# EAGLE design untitled (EAGLE 7.3.0)
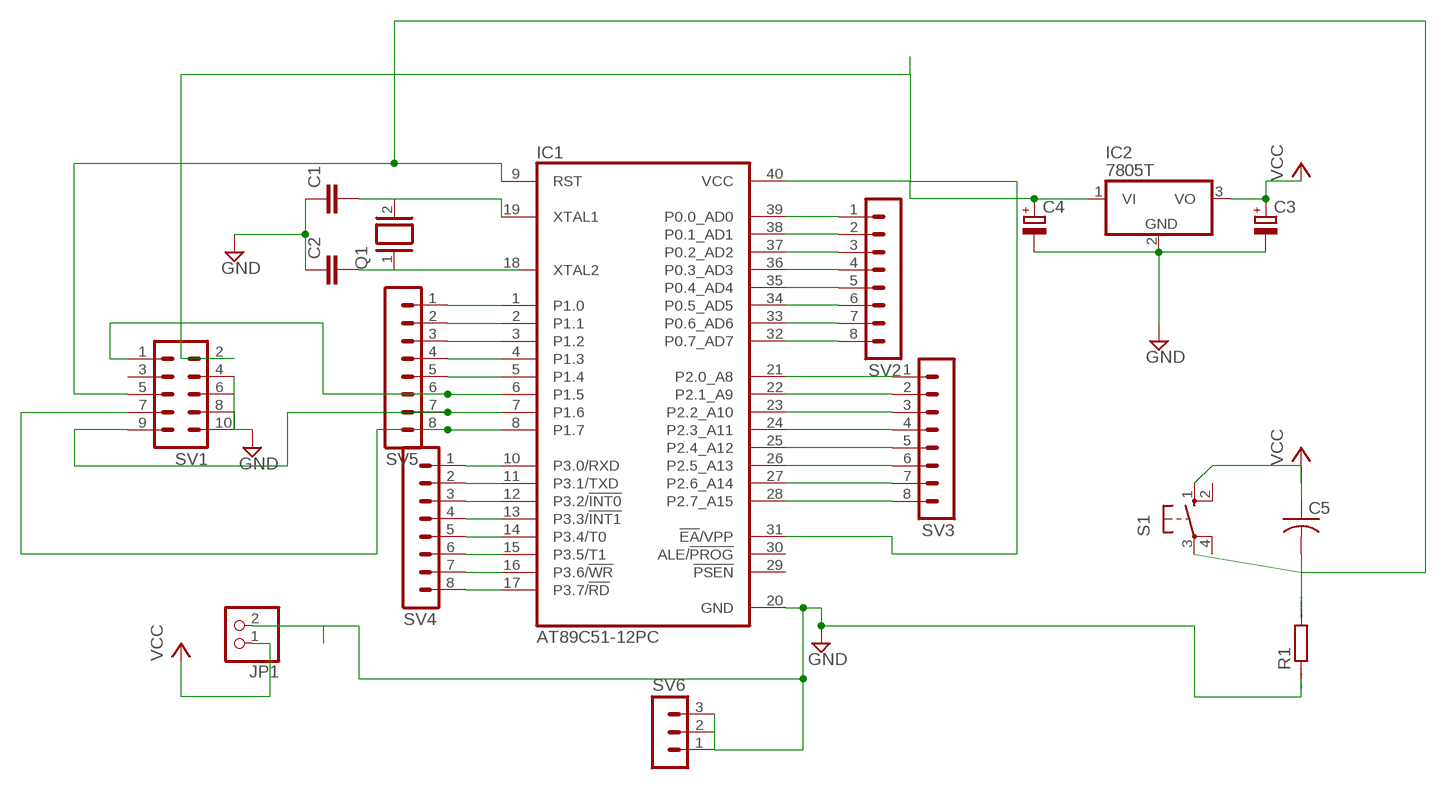
[diagram p0: schematic, sheet 1]

## Parts
C1  C2,5-3  [C2.5-3]
C2  C2,5-3  [C2.5-3]
C3  CPOL-EUB45181A  [B45181A]
C4  CPOL-EUB45181A  [B45181A]
C5  C-US025-024X044  [C025-024X044]
IC1  AT89C51-12PC  [DIL40]
IC2  7805T  [TO220H]
JP1  PINHD-1X2  [1X02]
Q1  XTAL/S  [QS]
R1  R0204/7  [0204/7]
S1  10-XX  [B3F-10XX]
SV1  MA05-2  [MA05-2]
SV2  MA08-1  [MA08-1]
SV3  MA08-1  [MA08-1]
SV4  MA08-1  [MA08-1]
SV5  MA08-1  [MA08-1]
SV6  MA03-1  [MA03-1]

## Nets
GND: C1.1 C2.1 C3.- C4.- IC1.20(GND) IC2.2(GND) JP1.2 R1.1 SV1.4 SV1.6 SV1.8 SV1.10 SV6.1 SV6.2 SV6.3
N$1: IC1.6(P1.5) SV1.1 SV5.6
N$2: IC1.7(P1.6) SV1.9 SV5.7
N$3: IC1.8(P1.7) SV1.7 SV5.8
N$4: C1.2 IC1.19(XTAL1) Q1.2
N$5: C2.2 IC1.18(XTAL2) Q1.1
N$7: C4.+ IC1.31(!EA!/VPP) IC1.40(VCC) IC2.1(VI) SV1.2
N$10: IC1.10(P3.0/RXD) SV4.1
N$11: IC1.11(P3.1/TXD) SV4.2
N$12: IC1.12(P3.2/!INT0) SV4.3
N$13: IC1.13(P3.3/!INT1) SV4.4
N$14: IC1.14(P3.4/T0) SV4.5
N$15: IC1.15(P3.5/T1) SV4.6
N$16: IC1.16(P3.6/!WR) SV4.7
N$17: IC1.17(P3.7/!RD) SV4.8
N$18: IC1.1(P1.0) SV5.1
N$19: IC1.2(P1.1) SV5.2
N$20: IC1.3(P1.2) SV5.3
N$21: IC1.4(P1.3) SV5.4
N$22: IC1.5(P1.4) SV5.5
N$23: IC1.21(P2.0_A8) SV3.1
N$24: IC1.22(P2.1_A9) SV3.2
N$25: IC1.23(P2.2_A10) SV3.3
N$26: IC1.24(P2.3_A11) SV3.4
N$27: IC1.25(P2.4_A12) SV3.5
N$28: IC1.26(P2.5_A13) SV3.6
N$29: IC1.27(P2.6_A14) SV3.7
N$30: IC1.28(P2.7_A15) SV3.8
N$31: IC1.39(P0.0_AD0) SV2.1
N$32: IC1.38(P0.1_AD1) SV2.2
N$33: IC1.37(P0.2_AD2) SV2.3
N$34: IC1.36(P0.3_AD3) SV2.4
N$35: IC1.35(P0.4_AD4) SV2.5
N$36: IC1.34(P0.5_AD5) SV2.6
N$37: IC1.33(P0.6_AD6) SV2.7
N$38: IC1.32(P0.7_AD7) SV2.8
N$40: C5.2 IC1.9(RST) R1.2 S1.3(P) SV1.5
VCC: C3.+ C5.1 IC2.3(VO) JP1.1 S1.1(S)
Unconnected: IC1.29(!PSEN) IC1.30(ALE/!PROG) S1.2(S1) S1.4(P1) SV1.3

## Library data of the parts
C1 C2 = capacitor-wima:C: CAPACITOR naming: grid - package width
C3 C4 = resistor:CPOL-EU: POLARIZED CAPACITOR, European symbol
C5 = rcl:C-US: CAPACITOR, American symbol
IC1 = atmel:AT89C51-*: 8-bit Microcontroller with 4K Bytes Flash Not Recommended for New Designs. Use AT89S51. Source: http://www.atmel.com/dyn/resources/prod_documents/doc0265.; OC_FARNELL: unknown; OC_NEWARK: unknown
IC2 = linear:78*: Positive VOLTAGE REGULATOR Source: http://cache.national.com/ds/LM/LM78L05.pdf http://www.fairchildsemi.com/ds/LM/LM7805.pdf
JP1 = pinhead:PINHD-1X2: PIN HEADER
Q1 = special:XTAL/S: CRYSTAL
R1 = eagle-ltspice:R: RESISTOR, European symbol; SPICEMODEL: NONE; SPICEPREFIX: R
S1 = switch-omron:10-XX: OMRON SWITCH; MPN: B3F-1000; OC_FARNELL: 176432; OC_NEWARK: 36M3542
SV1 = con-lstb:MA05-2: PIN HEADER; OC_FARNELL: unknown; OC_NEWARK: unknown
SV2-SV5 = con-lstb:MA08-1: PIN HEADER; OC_FARNELL: unknown; OC_NEWARK: unknown
SV6 = con-lstb:MA03-1: PIN HEADER; OC_FARNELL: unknown; OC_NEWARK: unknown

## Board
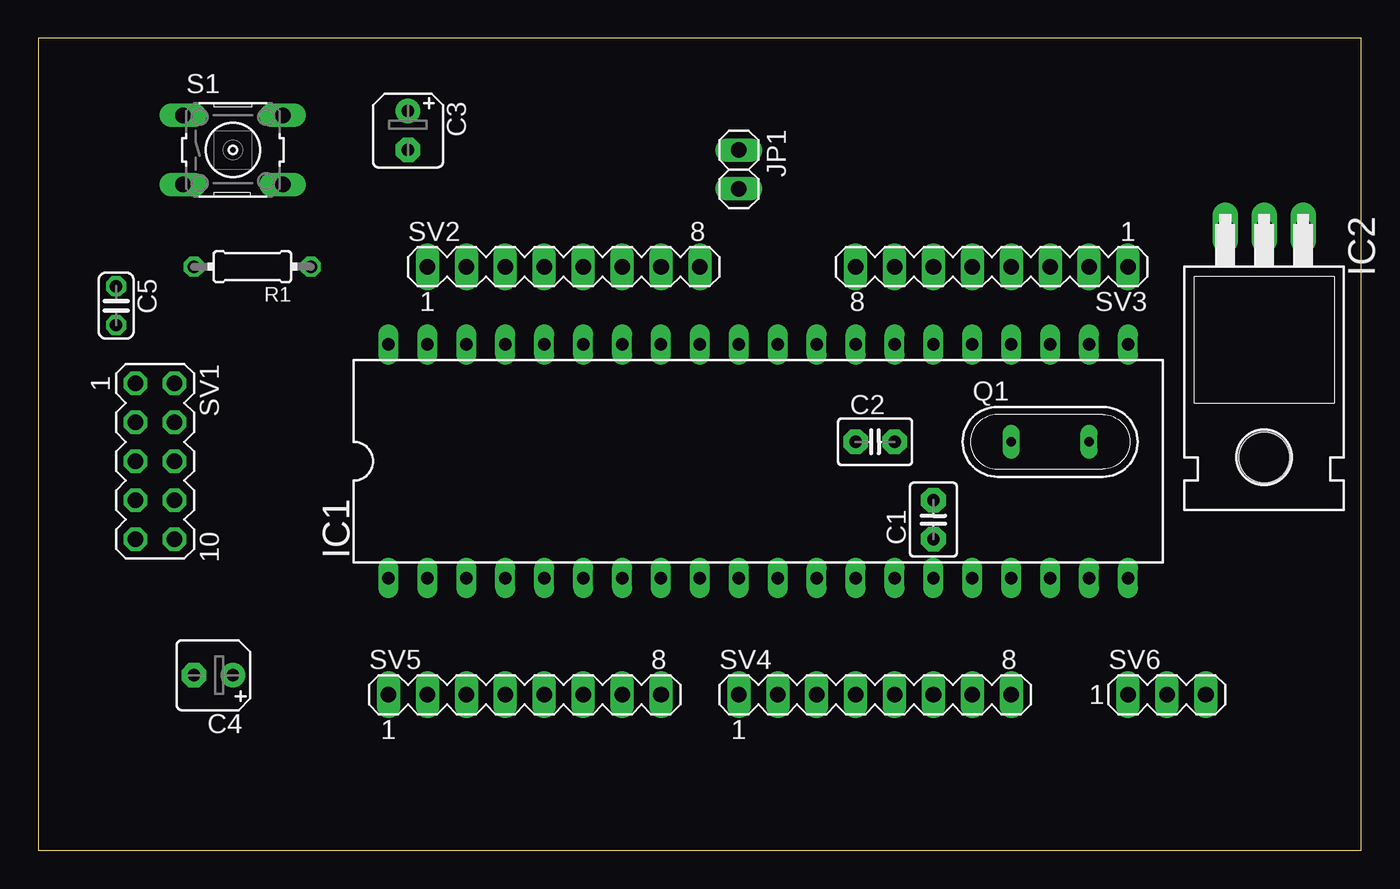
[diagram p1: board, top side]
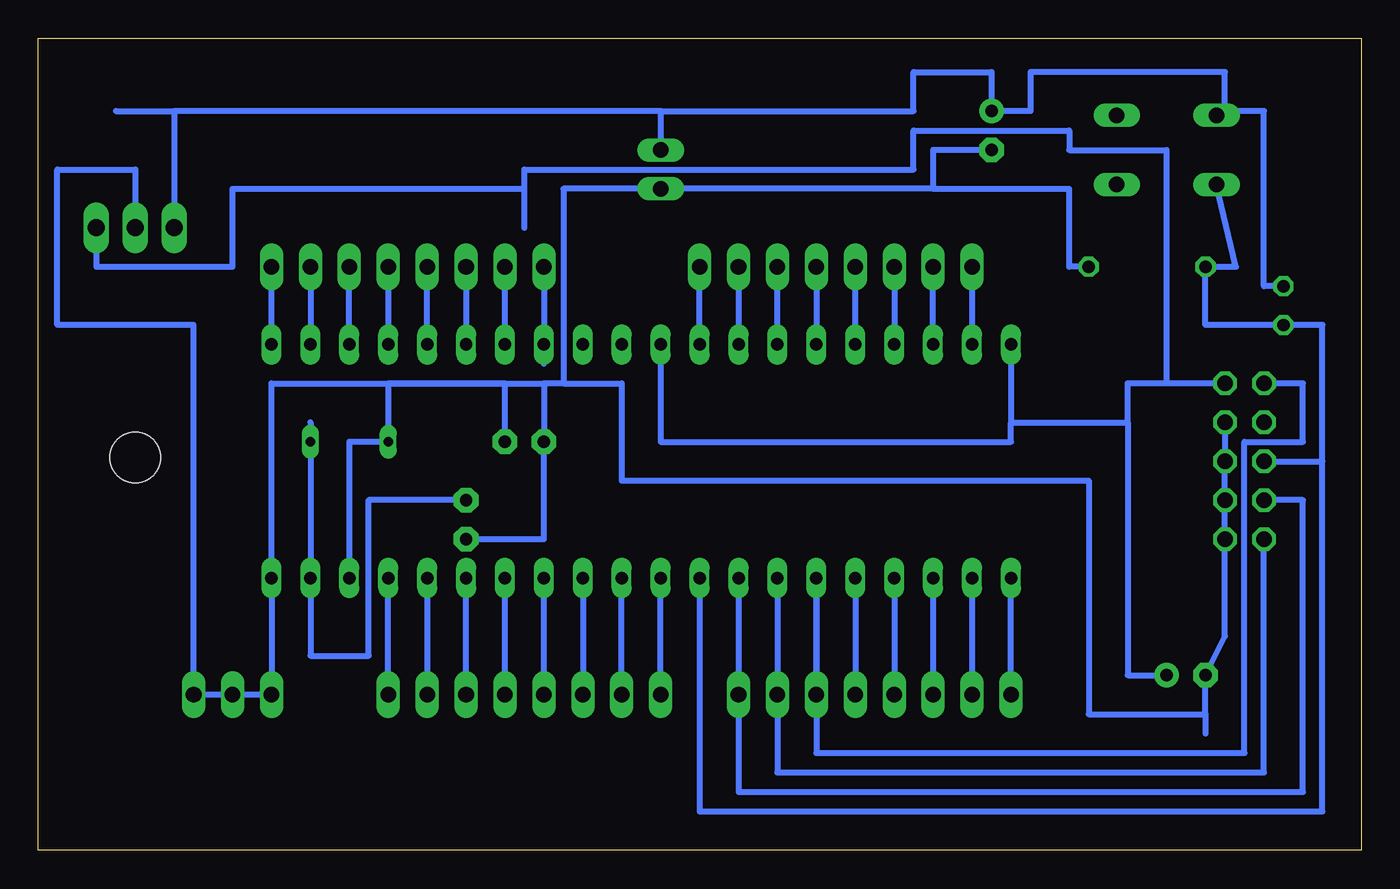
[diagram p2: board, bottom side, seen from below]

Size 86.34 x 53.01 mm. Coordinates in mm from the lower left corner, seen from the top.
Outline: 0,0 86.34,0 86.34,53.01 0,53.01 0,0
Copper layers (1*16): Top 0.035mm / dielectric 1.5mm / Bottom 0.035mm
Design rules "default": minimum track width 10mil, minimum drill 24mil, track to track 8mil, track to pad 8mil, pad to pad 8mil, via to via 8mil, smd to smd 8mil, copper to edge 40mil, drill to drill 8mil, minimum pad ring 10mil, minimum via ring 8mil, stop-mask expansion 4mil, vias tented up to drill 0mil, thermal gap 10mil

### Footprints (pad centres in the part's own frame; a part is rotated, then mirrored left to right if it is on the bottom)
C2.5-3 = drill 0.813 pad 1.6 octagon: 1 -1.27,0; 2 1.27,0
B45181A = drill 0.813 pad 1.6: + -1.27,0 | drill 0.813 pad 1.6 octagon: - 1.27,0
C025-024X044 = drill 0.813 octagon: 1 -1.27,0; 2 1.27,0
DIL40 = drill 0.813 long: 1 -24.13,-7.62; 2 -21.59,-7.62; 3 -19.05,-7.62; 4 -16.51,-7.62; 5 -13.97,-7.62; 6 -11.43,-7.62; 7 -8.89,-7.62; 8 -6.35,-7.62; 9 -3.81,-7.62; 10 -1.27,-7.62; 11 1.27,-7.62; 12 3.81,-7.62; 13 6.35,-7.62; 14 8.89,-7.62; 15 11.43,-7.62; 16 13.97,-7.62; 17 16.51,-7.62; 18 19.05,-7.62; 19 21.59,-7.62; 20 24.13,-7.62; 21 24.13,7.62; 22 21.59,7.62; 23 19.05,7.62; 24 16.51,7.62; 25 13.97,7.62; 26 11.43,7.62; 27 8.89,7.62; 28 6.35,7.62; 29 3.81,7.62; 30 1.27,7.62; 31 -1.27,7.62; 32 -3.81,7.62; 33 -6.35,7.62; 34 -8.89,7.62; 35 -11.43,7.62; 36 -13.97,7.62; 37 -16.51,7.62; 38 -19.05,7.62; 39 -21.59,7.62; 40 -24.13,7.62
TO220H = drill 1.118 long: 1 -2.54,-10.16; 2 0,-10.16; 3 2.54,-10.16 | hole 3.302: 0,4.826
1X02 = drill 1.016 long: 1 -1.27,0; 2 1.27,0
QS = drill 0.61 long: 1 -2.54,0; 2 2.54,0
0204/7 = drill 0.813 octagon: 1 -3.81,0; 2 3.81,0
B3F-10XX = drill 1.016 long: 1 -3.251,2.261; 2 3.251,2.261; 3 -3.251,-2.261; 4 3.251,-2.261
MA05-2 = drill 1.016 octagon: 1 -5.08,-1.27; 2 -5.08,1.27; 3 -2.54,-1.27; 4 -2.54,1.27; 5 0,-1.27; 6 0,1.27; 7 2.54,-1.27; 8 2.54,1.27; 9 5.08,-1.27; 10 5.08,1.27
MA08-1 = drill 1.016 long: 1 -8.89,0; 2 -6.35,0; 3 -3.81,0; 4 -1.27,0; 5 1.27,0; 6 3.81,0; 7 6.35,0; 8 8.89,0
MA03-1 = drill 1.016 long: 1 -2.54,0; 2 0,0; 3 2.54,0

### Placement (x,y rotation side)
C1  58.42,21.59 90 top
C2  54.61,26.67 0 top
C3  24.13,46.99 270 top
C4  11.43,11.43 180 top
C5  5.08,35.56 270 top
IC1  46.99,25.4 0 top
IC2  80.01,30.48 180 top
JP1  45.72,44.45 270 top
Q1  66.04,26.67 0 top
R1  13.97,38.1 180 top
S1  12.7,45.72 0 top
SV1  7.62,25.4 270 top
SV2  34.29,38.1 0 top
SV3  62.23,38.1 180 top
SV4  54.61,10.16 0 top
SV5  31.75,10.16 0 top
SV6  73.66,10.16 0 top

### Tracks (layer width: path | path; a pad name or v marks a point on that pad's centre or on a via)
GND
  Bottom 0.406: 53.34,30.48 71.12,30.48 IC1.20 SV6.1 SV6.2 SV6.3 76.2,34.29 85.09,34.29 85.09,44.45 80.01,44.45 IC2.2 | 53.34,30.48 C2.1 | 53.34,25.4 C2.1 | C1.1 53.34,20.32 C2.1 | 27.94,43.18 19.05,43.18 19.05,38.1 R1.1 | C3.- 27.94,45.72 27.94,43.18 | 52.07,30.48 53.34,30.48 | SV1.4 SV1.6 SV1.8 SV1.10 8.89,13.97 C4.- 10.16,8.89 | 27.94,43.18 JP1.2 52.07,43.18 52.07,30.48 | 52.07,30.48 48.26,30.48 48.26,24.13 17.78,24.13 17.78,8.89 10.16,8.89 | 10.16,8.89 10.16,7.62
N$1
  Bottom 0.406: SV5.6 IC1.6 35.56,6.35 7.62,6.35 7.62,26.67 3.81,26.67 3.81,30.48 SV1.1
N$2
  Bottom 0.406: IC1.7 SV5.7 | SV5.7 38.1,8.89 | SV5.7 38.1,5.08 6.35,5.08 SV1.9
N$3
  Bottom 0.406: SV5.8 IC1.8 40.64,3.81 3.81,3.81 3.81,22.86 SV1.7
N$4
  Bottom 0.406: 68.58,27.94 Q1.2 IC1.19 68.58,12.7 64.77,12.7 64.77,22.86 C1.2
N$5
  Bottom 0.406: IC1.18 66.04,26.67 Q1.1 63.5,30.48 55.88,30.48 C2.2
N$7
  Bottom 0.406: IC1.31 45.72,26.67 22.86,26.67 22.86,27.94 | IC1.40 22.86,27.94 | 22.86,27.94 15.24,27.94 | 15.24,27.94 15.24,30.48 12.7,30.48 | SV1.2 12.7,30.48 | 15.24,27.94 15.24,11.43 C4.+ | 54.61,40.64 54.61,43.18 | 54.61,43.18 54.61,44.45 29.21,44.45 29.21,46.99 19.05,46.99 19.05,45.72 12.7,45.72 12.7,30.48 | IC2.1 82.55,38.1 73.66,38.1 73.66,43.18 54.61,43.18
N$10
  Bottom 0.406: SV4.1 IC1.10
N$11
  Bottom 0.406: SV4.2 IC1.11
N$12
  Bottom 0.406: IC1.12 SV4.3
N$13
  Bottom 0.406: SV4.4 IC1.13
N$14
  Bottom 0.406: SV4.5 IC1.14
N$15
  Bottom 0.406: SV4.6 IC1.15
N$16
  Bottom 0.406: IC1.16 SV4.7
N$17
  Bottom 0.406: SV4.8 IC1.17
N$18
  Bottom 0.406: SV5.1 IC1.1
N$19
  Bottom 0.406: IC1.2 SV5.2
N$20
  Bottom 0.406: IC1.3 SV5.3
N$21
  Bottom 0.406: IC1.4 SV5.4
N$22
  Bottom 0.406: IC1.5 SV5.5
N$23
  Bottom 0.406: IC1.21 SV3.1
N$24
  Bottom 0.406: SV3.2 IC1.22
N$25
  Bottom 0.406: IC1.23 SV3.3
N$26
  Bottom 0.406: SV3.4 IC1.24
N$27
  Bottom 0.406: IC1.25 SV3.5
N$28
  Bottom 0.406: SV3.6 IC1.26
N$29
  Bottom 0.406: IC1.27 SV3.7
N$30
  Bottom 0.406: SV3.8 IC1.28 53.34,31.75
N$31
  Bottom 0.406: SV2.1 IC1.39
N$32
  Bottom 0.406: IC1.38 SV2.2
N$33
  Bottom 0.406: SV2.3 IC1.37
N$34
  Bottom 0.406: IC1.36 SV2.4
N$35
  Bottom 0.406: SV2.5 IC1.35
N$36
  Bottom 0.406: IC1.34 SV2.6
N$37
  Bottom 0.406: SV2.7 IC1.33
N$38
  Bottom 0.406: IC1.32 SV2.8
N$40
  Bottom 0.406: SV1.5 2.54,25.4 | 2.54,25.4 2.54,34.29 C5.2 10.16,34.29 R1.2 8.18,38.1 S1.3 | IC1.9 43.18,2.54 2.54,2.54 2.54,25.4
VCC
  Bottom 0.406: 45.72,48.26 JP1.1 | 45.72,48.26 29.21,48.26 29.21,50.8 24.13,50.8 C3.+ 21.59,48.26 21.59,50.8 8.89,50.8 8.89,47.98 S1.1 9.45,48.26 6.35,48.26 6.35,36.83 C5.1 | 45.72,48.26 77.47,48.26 | 81.28,48.26 77.47,48.26 | 77.47,48.26 IC2.3